# Altium schematic sheet P10_HDMI Framer.SchDoc
size 386 x 246 mm
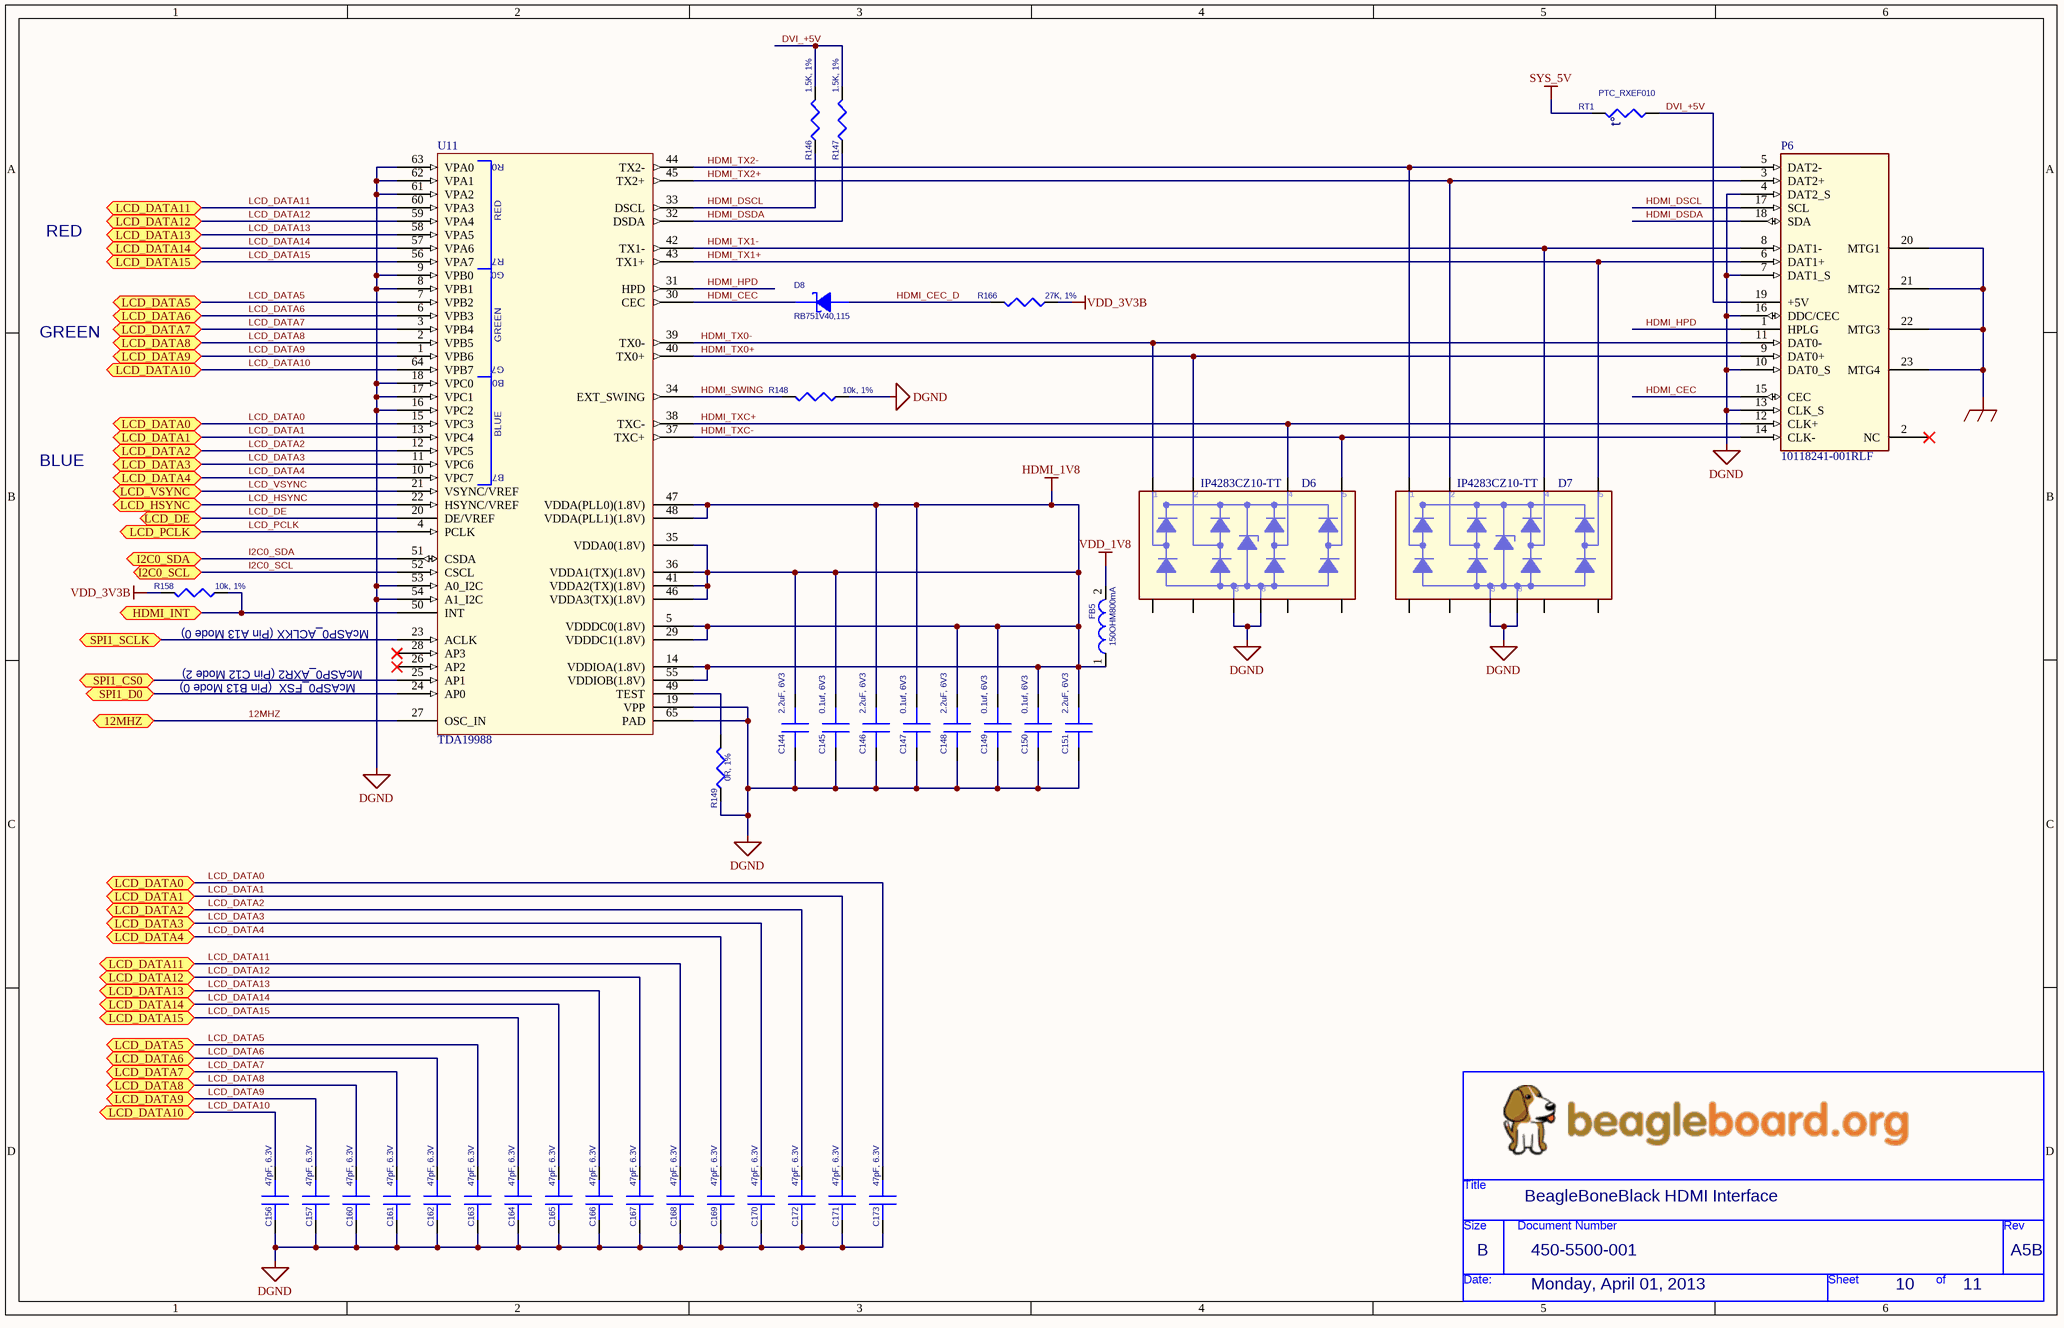
[diagram p0: P10_HDMI Framer.SchDoc]

## Parts
*  Page Create Date: Monday, April 01, 2013  Doc: 450-5500-001  RevCode: A5B  Title: BeagleBoneBlack HDMI Interface  Page Size: B  Page Number: 10  Page Count: 11  (hidden comment: BeagleBoard_org)  (graphical)
C144  2.2uF, 6V3  [402]
C145  0.1uf, 6V3  [402]
C146  2.2uF, 6V3  [402]
C147  0.1uf, 6V3  [402]
C148  2.2uF, 6V3  [402]
C149  0.1uf, 6V3  [402]
C150  0.1uf, 6V3  [402]
C151  2.2uF, 6V3  [402]
C156  47pF, 6.3V  [402]
C157  47pF, 6.3V  [402]
C160  47pF, 6.3V  [402]
C161  47pF, 6.3V  [402]
C162  47pF, 6.3V  [402]
C163  47pF, 6.3V  [402]
C164  47pF, 6.3V  [402]
C165  47pF, 6.3V  [402]
C166  47pF, 6.3V  [402]
C167  47pF, 6.3V  [402]
C168  47pF, 6.3V  [402]
C169  47pF, 6.3V  [402]
C170  47pF, 6.3V  [402]
C171  47pF, 6.3V  [402]
C172  47pF, 6.3V  [402]
C173  47pF, 6.3V  [402]
D6  IP4283CZ10-TT  [TSSOP10]
D7  IP4283CZ10-TT  [TSSOP10]
D8  RB751V40,115  [SOD323]
FB5  150OHM800mA  [SM-7351-IND-0805]
P6  10118241-001RLF  [CONN19_HDMI]
R146  1.5K, 1%  [402]
R147  1.5K, 1%  [402]
R148  10k, 1%  [402]
R149  0R, 1%  [402]
R158  10k, 1%  [402]
R166  27K, 1%  [402]
RT1  PTC_RXEF010  [POLYSW200-5638-310]
U11  TDA19988  [QFN64S9X9P5]

## Ports
12MHZ, HDMI_INT, I2C0_SCL, I2C0_SDA, LCD_DATA0, LCD_DATA1, LCD_DATA2, LCD_DATA3, LCD_DATA4, LCD_DATA5, LCD_DATA6, LCD_DATA7, LCD_DATA8, LCD_DATA9, LCD_DATA10, LCD_DATA11, LCD_DATA12, LCD_DATA13, LCD_DATA14, LCD_DATA15, LCD_DE, LCD_HSYNC, LCD_PCLK, LCD_VSYNC, SPI1_CS0, SPI1_D0, SPI1_SCLK

## Nets
DGND: C144.2 C145.2 C146.2 C147.2 C148.2 C149.2 C150.2 C151.2 C156.2 C157.2 C160.2 C161.2 C162.2 C163.2 C164.2 C165.2 C166.2 C167.2 C168.2 C169.2 C170.2 C171.2 C172.2 C173.2 D6.3 D6.8 D7.3 D7.8 P6.4(DAT2_S) P6.7(DAT1_S) P6.10(DAT0_S) P6.13(CLK_S) P6.16(DDC/CEC) R148.2(P2) R149.2(P2) U11.8(VPB1) U11.9(VPB0) U11.16(VPC2) U11.17(VPC1) U11.18(VPC0) U11.19(VPP) U11.53(A0_I2C) U11.54(A1_I2C) U11.61(VPA2) U11.62(VPA1) U11.63(VPA0) U11.65(PAD)
GND_EARTH: P6.20(MTG1) P6.21(MTG2) P6.22(MTG3) P6.23(MTG4)
HDMI_1V8: C144.1 C145.1 C146.1 C147.1 C148.1 C149.1 C150.1 C151.1 FB5.1 U11.5(VDDDC0(1.8V)) U11.14(VDDIOA(1.8V)) U11.29(VDDDC1(1.8V)) U11.35(VDDA0(1.8V)) U11.36(VDDA1(TX)(1.8V)) U11.41(VDDA2(TX)(1.8V)) U11.46(VDDA3(TX)(1.8V)) U11.47(VDDA(PLL0)(1.8V)) U11.48(VDDA(PLL1)(1.8V)) U11.55(VDDIOB(1.8V))
SYS_5V: RT1.1(P1)
VDD_1V8: FB5.2
VDD_3V3B: R158.1(P1) R166.2(P2)
12MHZ: U11.27(OSC_IN) ; port 12MHZ
DVI_+5V: P6.19(+5V) R146.1(P1) R147.1(P1) RT1.2(P2)
HDMI_CEC: D8.1(C) P6.15(CEC) U11.30(CEC)
HDMI_CEC_D: D8.2(A) R166.1(P1)
HDMI_DSCL: P6.17(SCL) R146.2(P2) U11.33(DSCL)
HDMI_DSDA: P6.18(SDA) R147.2(P2) U11.32(DSDA)
HDMI_HPD: P6.1(HPLG) U11.31(HPD)
HDMI_INT: R158.2(P2) U11.50(INT) ; port HDMI_INT
HDMI_SWING: R148.1(P1) U11.34(EXT_SWING)
HDMI_TX0+: D6.2 P6.9(DAT0+) U11.40(TX0+)
HDMI_TX0-: D6.1 P6.11(DAT0-) U11.39(TX0-)
HDMI_TX1+: D7.5 P6.6(DAT1+) U11.43(TX1+)
HDMI_TX1-: D7.4 P6.8(DAT1-) U11.42(TX1-)
HDMI_TX2+: D7.2 P6.3(DAT2+) U11.45(TX2+)
HDMI_TX2-: D7.1 P6.5(DAT2-) U11.44(TX2-)
HDMI_TXC+: D6.4 P6.12(CLK+) U11.38(TXC-)
HDMI_TXC-: D6.5 P6.14(CLK-) U11.37(TXC+)
I2C0_SCL: U11.52(CSCL) ; port I2C0_SCL
I2C0_SDA: U11.51(CSDA) ; port I2C0_SDA
LCD_DATA0: C173.1 U11.15(VPC3) ; port LCD_DATA0
LCD_DATA1: C171.1 U11.13(VPC4) ; port LCD_DATA1
LCD_DATA2: C172.1 U11.12(VPC5) ; port LCD_DATA2
LCD_DATA3: C170.1 U11.11(VPC6) ; port LCD_DATA3
LCD_DATA4: C169.1 U11.10(VPC7) ; port LCD_DATA4
LCD_DATA5: C163.1 U11.7(VPB2) ; port LCD_DATA5
LCD_DATA6: C162.1 U11.6(VPB3) ; port LCD_DATA6
LCD_DATA7: C161.1 U11.3(VPB4) ; port LCD_DATA7
LCD_DATA8: C160.1 U11.2(VPB5) ; port LCD_DATA8
LCD_DATA9: C157.1 U11.1(VPB6) ; port LCD_DATA9
LCD_DATA10: C156.1 U11.64(VPB7) ; port LCD_DATA10
LCD_DATA11: C168.1 U11.60(VPA3) ; port LCD_DATA11
LCD_DATA12: C167.1 U11.59(VPA4) ; port LCD_DATA12
LCD_DATA13: C166.1 U11.58(VPA5) ; port LCD_DATA13
LCD_DATA14: C165.1 U11.57(VPA6) ; port LCD_DATA14
LCD_DATA15: C164.1 U11.56(VPA7) ; port LCD_DATA15
LCD_DE: U11.20(DE/VREF) ; port LCD_DE
LCD_HSYNC: U11.22(HSYNC/VREF) ; port LCD_HSYNC
LCD_PCLK: U11.4(PCLK) ; port LCD_PCLK
LCD_VSYNC: U11.21(VSYNC/VREF) ; port LCD_VSYNC
SPI1_CS0: U11.25(AP1) ; port SPI1_CS0
SPI1_D0: U11.24(AP0) ; port SPI1_D0
SPI1_SCLK: U11.23(ACLK) ; port SPI1_SCLK
NetR149_1: R149.1(P1) U11.49(TEST)

Not connected (* = marked no-connect by the designer): D6 6 7 9 10; D7 6 7 9 10; P6 2(NC)*; U11 26(AP2)* 28(AP3)*

## Notes on the sheet
- RED
- GREEN
- BLUE
- McASP0_AXR2 (Pin C12 Mode 2)
- (near R158) McASP0_ACLKX (Pin A13 Mode 0)
- McASP0_FSX  (Pin B13 Mode 0)
- (in symbol BeagleBoard_org) Title; Size; Document Number; Rev; Date:; Sheet; of
- (in symbol PTC) t°
- (in symbol TDA19988) R0; RED; R7; G0; GREEN; G7; B0; BLUE; B7

## Library data of the parts
C144 C146 C148 C151 = CAP SMD: CAP CER 2.2UF 6.3V 10% X5R 0402; Manufacturer: TDK Corporation; Manufacturer Part Number: C1005X5R0J225K050BC; Capacitance: 2.2µF; Supplier 1: Digi-Key; Supplier Part Number 1: 445-6847-6-ND; RoHS: RoHS Compliant; Category: Capacitors; Stock 1: 186346; Pricing 1: 1=0.24, 10=0.2, 100=0.1, 250=0.075, 500=0.06626, 1000=0.05875, 5000=0.04875 (USD); Voltage - Rated: 6.3V; Tolerance: ±10%; Temperature Coefficient: X5R; Mounting Type: Surface Mount, MLCC; Operating Temperature: -55°C ~ 85°C; Applications: General Purpose; Ratings: -; Package / Case: 0402 (1005 Metric); Size / Dimension: 0.039" L x 0.020" W (1.00mm x 0.50mm); Height - Seated (Max): -; Thickness (Max): 0.022" (0.55mm); Lead Spacing: -; Features: -; Packaging: Digi-Reel®; Lead Style: -; ComponentLink1URL: http://product.tdk.com/capacitor/mlcc/en/documents/mlcc_commercial_general_en.pdf; ComponentLink1Description: http://product.tdk.com/capacitor/mlcc/en/documents/mlcc_commercial_general_en.pdf
C145 C147 C149 C150 = CAP SMD: CAP CER 0.1UF 6.3V 10% X5R 0402; Manufacturer: TDK Corporation; Manufacturer Part Number: C1005X5R0J104K050BA; Capacitance: 0.1µF; Supplier 1: Digi-Key; Supplier Part Number 1: 445-1266-6-ND; RoHS: RoHS Compliant; Category: Capacitors; Stock 1: 127094; Pricing 1: 1=0.1, 10=0.026, 100=0.0121, 250=0.00992, 500=0.00848, 1000=0.0066, 5000=0.0055 (USD); Voltage - Rated: 6.3V; Tolerance: ±10%; Temperature Coefficient: X5R; Mounting Type: Surface Mount, MLCC; Operating Temperature: -55°C ~ 85°C; Applications: General Purpose; Ratings: -; Package / Case: 0402 (1005 Metric); Size / Dimension: 0.039" L x 0.020" W (1.00mm x 0.50mm); Height - Seated (Max): -; Thickness (Max): 0.022" (0.55mm); Lead Spacing: -; Features: -; Packaging: Digi-Reel®; Lead Style: -; ComponentLink1URL: http://product.tdk.com/capacitor/mlcc/en/documents/mlcc_commercial_general_en.pdf; ComponentLink1Description: http://product.tdk.com/capacitor/mlcc/en/documents/mlcc_commercial_general_en.pdf
C156 C157 C160-C173 = CAP SMD: CAP CER 47PF 50V 5% NP0 0402; Manufacturer: TDK Corporation; Manufacturer Part Number: C1005C0G1H470J050BA; Temperature Coefficient: C0G, NP0; Supplier 1: Digi-Key; Supplier Part Number 1: 445-1243-6-ND; RoHS: RoHS Compliant; Category: Capacitors; Stock 1: 0; Pricing 1: 1=0.1, 10=0.024, 100=0.011, 250=0.009, 500=0.0077, 1000=0.006, 5000=0.005 (USD); Capacitance: 47pF; Voltage - Rated: 50V; Tolerance: ±5%; Mounting Type: Surface Mount, MLCC; Operating Temperature: -55°C ~ 125°C; Applications: General Purpose; Ratings: -; Package / Case: 0402 (1005 Metric); Size / Dimension: 0.039" L x 0.020" W (1.00mm x 0.50mm); Height - Seated (Max): -; Thickness (Max): 0.022" (0.55mm); Lead Spacing: -; Features: -; Packaging: Digi-Reel®; Lead Style: -; ComponentLink1URL: http://product.tdk.com/capacitor/mlcc/en/documents/mlcc_commercial_general_en.pdf; ComponentLink1Description: http://product.tdk.com/capacitor/mlcc/en/documents/mlcc_commercial_general_en.pdf
D6 D7 = 32CTQ030/TO_1: DIODE ESD PROT HDMI 10TSSOP; Manufacturer: NXP Semiconductors; Manufacturer Part Number: IP4283CZ10-TT,118; Voltage - Reverse Standoff (Typ): 3V; Voltage - Breakdown: 6V; Polarization: 4 Channel Array - Unidirectional; Supplier 1: Digi-Key; Supplier Part Number 1: 568-5875-6-ND; RoHS: RoHS Compliant; Category: Circuit Protection; Stock 1: 1067; Pricing 1: 1=0.85, 10=0.743, 25=0.6568, 100=0.5724, 250=0.49828, 500=0.42416, 1000=0.33974 (USD); Power (Watts): -; Mounting Type: Surface Mount; Package / Case: 10-TFSOP, 10-MSOP (0.118", 3.00mm Width); Supplier Device Package: 10-TSSOP; Packaging: Digi-Reel®; ComponentLink1URL: http://media.digikey.com/pdf/Data%20Sheets/NXP%20PDFs/IP4283CZ10.pdf; ComponentLink1Description: http://media.digikey.com/pdf/Data%20Sheets/NXP%20PDFs/IP4283CZ10.pdf
D8 = Zener: DIODE SCHOTTKY 40V 120MA SOD323; Manufacturer: NXP Semiconductors; Current - Average Rectified (Io): 120mA (DC); Voltage - Forward (Vf) (Max) @ If: 370mV @ 1mA; Speed: Small Signal =< 200mA (Io), Any Speed; Current - Reverse Leakage @ Vr: 500nA @ 30V; Capacitance @ Vr, F: 2pF @ 1V, 1MHz; Supplier 1: Digi-Key; Supplier Part Number 1: 568-8119-6-ND; Manufacturer Part Number: RB751V40,115; RoHS: RoHS Compliant; Category: Discrete Semiconductor Products; Stock 1: 5326; Pricing 1: 1=0.29, 10=0.26, 25=0.1872, 100=0.1456, 250=0.09152, 500=0.07798, 1000=0.05313 (USD); Diode Type: Schottky; Voltage - DC Reverse (Vr) (Max): 40V; Reverse Recovery Time (trr): -; Mounting Type: Surface Mount; Package / Case: SC-76, SOD-323; Supplier Device Package: SOD-323; Packaging: Digi-Reel®; ComponentLink1URL: http://www.nxp.com/documents/data_sheet/RB751_SER.pdf; ComponentLink1Description: http://www.nxp.com/documents/data_sheet/RB751_SER.pdf
FB5 = IND: FERRITE 800MA 150 OHM 0805 SMD; Manufacturer: Laird-Signal Integrity Products; Manufacturer Part Number: LI0805H151R-10; Impedance @ Frequency: 150 Ohm @ 100MHz; DC Resistance (DCR): 150 mOhm Max; Filter Type: Differential Mode - Single; Supplier 1: Digi-Key; Supplier Part Number 1: 240-2384-6-ND; RoHS: RoHS Compliant; Category: Filters; Stock 1: 10144; Pricing 1: 1=0.1, 10=0.07, 25=0.064, 50=0.0574, 100=0.0421, 250=0.03064, 500=0.02808, 1000=0.02424 (USD); Current Rating: 800mA; Package / Case: 0805 (2012 Metric); Mounting Type: Surface Mount; Packaging: Digi-Reel®; Height (Max): 0.043" (1.10mm); Size / Dimension: 0.079" L x 0.049" W (2.00mm x 1.25mm); ComponentLink1URL: http://www.lairdtech.com/WorkArea/linkit.aspx?LinkIdentifier=id&ItemID=4912; ComponentLink1Description: http://www.lairdtech.com/WorkArea/linkit.aspx?LinkIdentifier=id&ItemID=4912
P6 = Micro HDMI: CONN HDMI RECPT 19POS SMT R/A; Manufacturer: FCI; Number of Contacts: 19; Gender: Receptacle; Supplier 1: Digi-Key; Supplier Part Number 1: 609-4615-6-ND; Manufacturer Part Number: 10118241-001RLF; RoHS: RoHS Compliant; Category: Connectors, Interconnects; Stock 1: 6779; Pricing 1: 1=1.34, 10=1.174, 25=1.1052, 50=1.059, 100=1.013, 250=0.92092 (USD); Connector Type: HDMI; Specifications: -; Mounting Type: Surface Mount, Right Angle, Horizontal; Features: Shielded, Solder Retention; Packaging: Digi-Reel®; Ingress Protection: -; ComponentLink1URL: http://portal.fciconnect.com/Comergent//fci/drawing/10118241.pdf; ComponentLink1Description: http://portal.fciconnect.com/Comergent//fci/drawing/10118241.pdf
R146 R147 = RES SMD: RES 1.50K OHM 1/16W 1% 0402 SMD; Manufacturer: Yageo; Manufacturer Part Number: RC0402FR-071K5L; Power (Watts): 0.063W, 1/16W; Temperature Coefficient: ±100ppm/°C; Supplier 1: Digi-Key; Supplier Part Number 1: 311-1.50KLRDKR-ND; RoHS: RoHS Compliant; Category: Resistors; Stock 1: 434146; Pricing 1: 1=0.1, 10=0.014, 25=0.0104, 100=0.0063, 250=0.0054, 500=0.00382, 1000=0.0027, 2500=0.00234, 5000=0.00203 (USD); Resistance (Ohms): 1.5k; Composition: Thick Film; Features: -; Tolerance: ±1%; Package / Case: 0402 (1005 Metric); Supplier Device Package: 0402; Size / Dimension: 0.039" L x 0.020" W (1.00mm x 0.50mm); Height: 0.016" (0.40mm); Number of Terminations: 2; Packaging: Digi-Reel®; ComponentLink1URL: http://www.yageo.com/documents/recent/PYu-RC0402_51_RoHS_L_6.pdf; ComponentLink1Description: http://www.yageo.com/documents/recent/PYu-RC0402_51_RoHS_L_6.pdf
R148 R158 = RES SMD: RES 10K OHM 1/16W 5% 0402 SMD; Manufacturer: Rohm Semiconductor; Manufacturer Part Number: MCR01MZPJ103; Power (Watts): 0.063W, 1/16W; Temperature Coefficient: ±200ppm/°C; Supplier 1: Digi-Key; Supplier Part Number 1: RHM10KJDKR-ND; RoHS: RoHS Compliant; Category: Resistors; Stock 1: 460442; Pricing 1: 1=0.1, 10=0.019, 25=0.014, 100=0.0078, 250=0.00596, 500=0.00476, 1000=0.0035, 5000=0.00251 (USD); Resistance (Ohms): 10k; Composition: Thick Film; Features: Automotive AEC-Q200 Qualified; Tolerance: ±5%; Package / Case: 0402 (1005 Metric); Supplier Device Package: 0402 (1005 Metric); Size / Dimension: 0.039" L x 0.020" W (1.00mm x 0.50mm); Height: 0.016" (0.40mm); Number of Terminations: 2; Packaging: Digi-Reel®; ComponentLink1URL: http://rohmfs.rohm.com/en/products/databook/datasheet/passive/resistor/chip_resistor/mcr_a.pdf; ComponentLink1Description: http://rohmfs.rohm.com/en/products/databook/datasheet/passive/resistor/chip_resistor/mcr_a.pdf
R149 = RES SMD: RES 0.0 OHM 1/16W 0402 SMD; Manufacturer: Yageo; Manufacturer Part Number: RC0402JR-070RL; Resistance (Ohms): 0.0; Power (Watts): 0.063W, 1/16W; Tolerance: Jumper; Supplier 1: Digi-Key; Supplier Part Number 1: 311-0.0JRDKR-ND; RoHS: RoHS Compliant; Category: Resistors; Stock 1: 4565215; Pricing 1: 1=0.1, 10=0.012, 25=0.0092, 100=0.0055, 250=0.00476, 500=0.00336, 1000=0.00237, 2500=0.00206, 5000=0.00178 (USD); Composition: Thick Film; Features: -; Temperature Coefficient: -; Package / Case: 0402 (1005 Metric); Supplier Device Package: 0402; Size / Dimension: 0.039" L x 0.020" W (1.00mm x 0.50mm); Height: 0.016" (0.40mm); Number of Terminations: 2; Packaging: Digi-Reel®; ComponentLink1URL: http://www.yageo.com/documents/recent/PYu-RC0402_51_RoHS_L_6.pdf; ComponentLink1Description: http://www.yageo.com/documents/recent/PYu-RC0402_51_RoHS_L_6.pdf
R166 = RES SMD: RES 27.0K OHM 1/16W 1% 0402 SMD; Manufacturer: Yageo; Manufacturer Part Number: RC0402FR-0727KL; Power (Watts): 0.063W, 1/16W; Temperature Coefficient: ±100ppm/°C; Supplier 1: Digi-Key; Supplier Part Number 1: 311-27.0KLRDKR-ND; RoHS: RoHS Compliant; Category: Resistors; Stock 1: 115508; Pricing 1: 1=0.1, 10=0.014, 25=0.0104, 100=0.0063, 250=0.0054, 500=0.00382, 1000=0.0027, 2500=0.00234, 5000=0.00203 (USD); Resistance (Ohms): 27k; Composition: Thick Film; Features: -; Tolerance: ±1%; Package / Case: 0402 (1005 Metric); Supplier Device Package: 0402; Size / Dimension: 0.039" L x 0.020" W (1.00mm x 0.50mm); Height: 0.016" (0.40mm); Number of Terminations: 2; Packaging: Digi-Reel®; ComponentLink1URL: http://www.yageo.com/documents/recent/PYu-RC0402_51_RoHS_L_6.pdf; ComponentLink1Description: http://www.yageo.com/documents/recent/PYu-RC0402_51_RoHS_L_6.pdf
RT1 = PTC: POLYSWITCH PTC RESET 0.1A; Manufacturer: TE Connectivity; Current - Hold (Ih) (Max): 100mA; Current - Trip (It): 200mA; Current - Max: 40A; Voltage - Max: 60V; R Min/Max: 2.500 ~ 4.500 Ohm; Time to Trip: 4s; Supplier 1: Digi-Key; Supplier Part Number 1: RXEF010-ND; Manufacturer Part Number: RXEF010; RoHS: RoHS Compliant; Category: Circuit Protection; Stock 1: 22325; Pricing 1: 1=0.32, 10=0.289, 100=0.2625, 500=0.20476, 1000=0.1764, 5000=0.1617, 10000=0.1365, 50000=0.13125, 100000=0.126 (USD); Package / Case: Radial, Disc; Packaging: Bulk; ComponentLink1URL: http://documents.tycoelectronics.com/commerce/DocumentDelivery/DDEController?Action=showdoc&DocId=Specification+Or+Standard%7FSCD25213%7FE%7Fpdf%7FEnglish%7FENG_SS_SCD25213_E.pdf; ComponentLink1Description: http://documents.tycoelectronics.com/commerce/DocumentDelivery/DDEController?Action=showdoc&DocId=Specification+Or+Standard%7FSCD25213%7FE%7Fpdf%7FEnglish%7FENG_SS_SCD25213_E.pdf
U11 = TDA19988: IC HDMI TRANSMITTER 64-HVQFN; Manufacturer: NXP Semiconductors; Manufacturer Part Number: TDA19988AHN/C1,551; Supplier 1: Digi-Key; Supplier Part Number 1: TDA19988AHN/C1,551-ND; RoHS: RoHS Compliant; Category: Integrated Circuits (ICs); Stock 1: 0; Pricing 1: 260=4.59 (USD); Type: HDMI Transmitter; Applications: Set-Top Boxes; Mounting Type: Surface Mount; Package / Case: 64-VFQFN Exposed Pad; Supplier Device Package: 64-HVQFN (9x9); Packaging: Tray